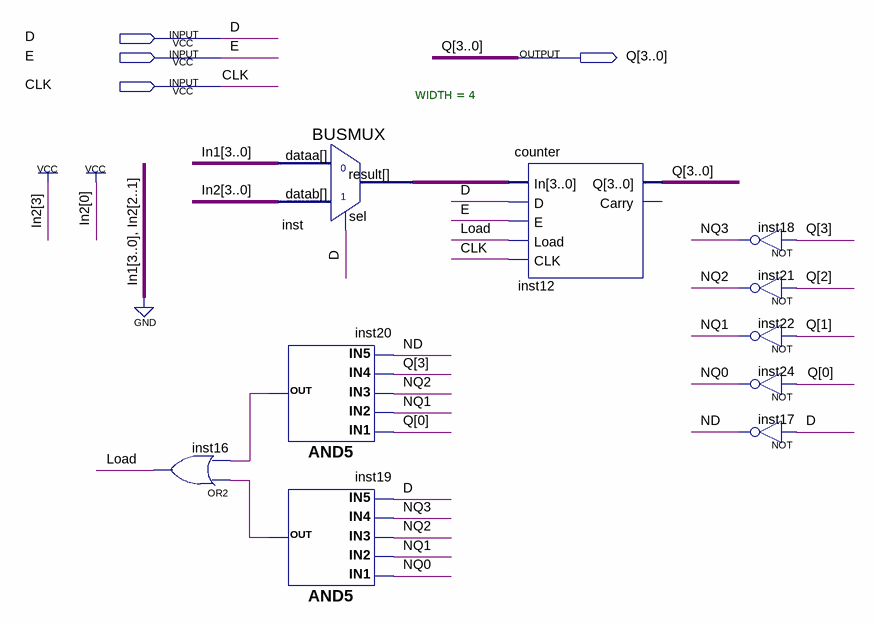
[diagram p0: schematic sheet]
// Quartus schematic BCDCounter.bdf as structural Verilog: 10 symbols, 4 pins
module BCDCounter (
  input  D,
  input  E,
  input  CLK,
  output [3:0] Q
);

  wire inst19_out, inst20_out, Load, ND, NQ0, NQ1, NQ2, NQ3;
  wire [3:0] inst_result;

  or inst16 (Load, inst19_out, inst20_out);
  and inst20 (inst20_out, Q[0], NQ1, NQ2, Q[3], ND);
  and inst19 (inst19_out, NQ0, NQ1, NQ2, NQ3, D);
  BUSMUX #(.WIDTH(4)) inst (.datab(4'b1001), .sel(D), .dataa(4'b0000), .result(inst_result));
  counter inst12 (.In(inst_result), .D(D), .E(E), .Load(Load), .CLK(CLK), .Q(Q));  // open: Carry
  not inst18 (NQ3, Q[3]);
  not inst21 (NQ2, Q[2]);
  not inst22 (NQ1, Q[1]);
  not inst24 (NQ0, Q[0]);
  not inst17 (ND, D);
endmodule
